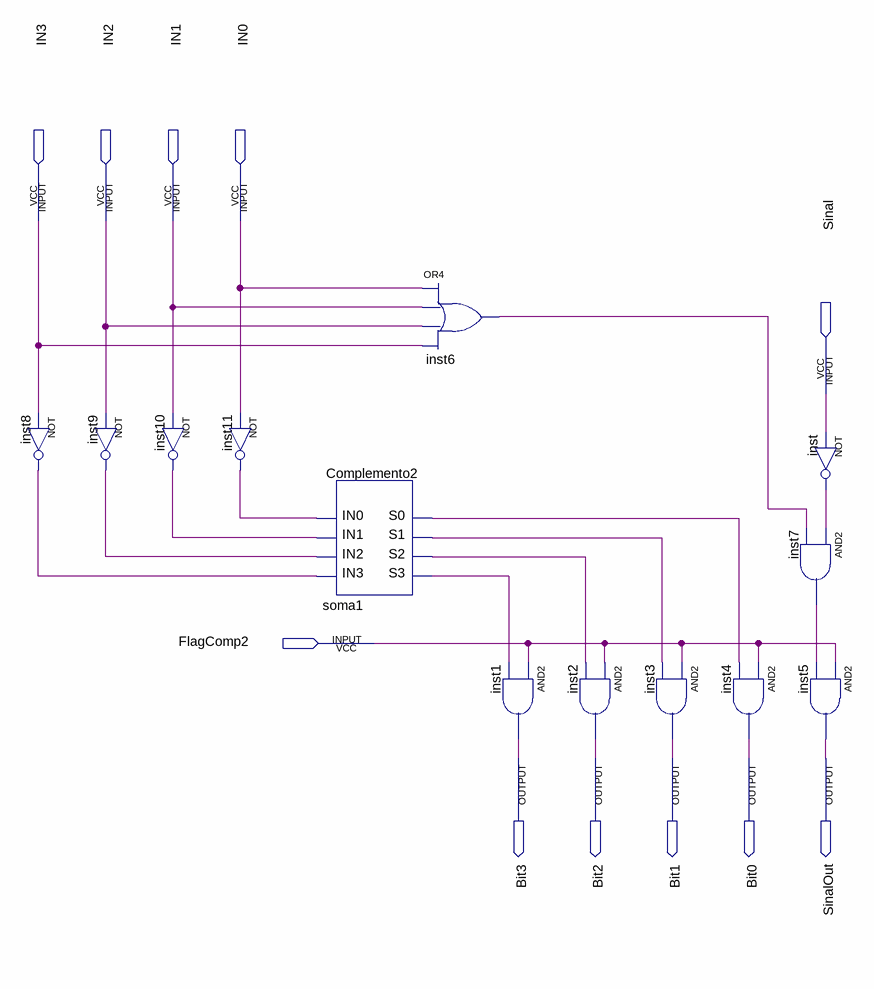
[diagram p0: schematic sheet]
// Quartus schematic Complemento_a_dois.bdf as structural Verilog: 13 symbols, 11 pins
module Complemento_a_dois (
  input  IN3,
  input  IN2,
  input  IN1,
  input  IN0,
  input  Sinal,
  input  FlagComp2,
  output Bit3,
  output Bit2,
  output Bit1,
  output Bit0,
  output SinalOut
);

  wire Complemento2_s0, Complemento2_s1, Complemento2_s2, Complemento2_s3, inst6_out, inst7_out, inst8_out,
       inst9_out, inst10_out, inst11_out, inst_out;

  not inst8 (inst8_out, IN3);
  not inst9 (inst9_out, IN2);
  not inst10 (inst10_out, IN1);
  not inst11 (inst11_out, IN0);
  soma1 Complemento2 (
    .IN3(inst8_out), .IN2(inst9_out), .IN1(inst10_out), .IN0(inst11_out), .S3(Complemento2_s3),
    .S2(Complemento2_s2), .S1(Complemento2_s1), .S0(Complemento2_s0));
  or inst6 (inst6_out, IN0, IN1, IN2, IN3);
  and inst1 (Bit3, FlagComp2, Complemento2_s3);
  and inst2 (Bit2, FlagComp2, Complemento2_s2);
  and inst3 (Bit1, FlagComp2, Complemento2_s1);
  and inst4 (Bit0, FlagComp2, Complemento2_s0);
  not inst (inst_out, Sinal);
  and inst7 (inst7_out, inst_out, inst6_out);
  and inst5 (SinalOut, FlagComp2, inst7_out);
endmodule
